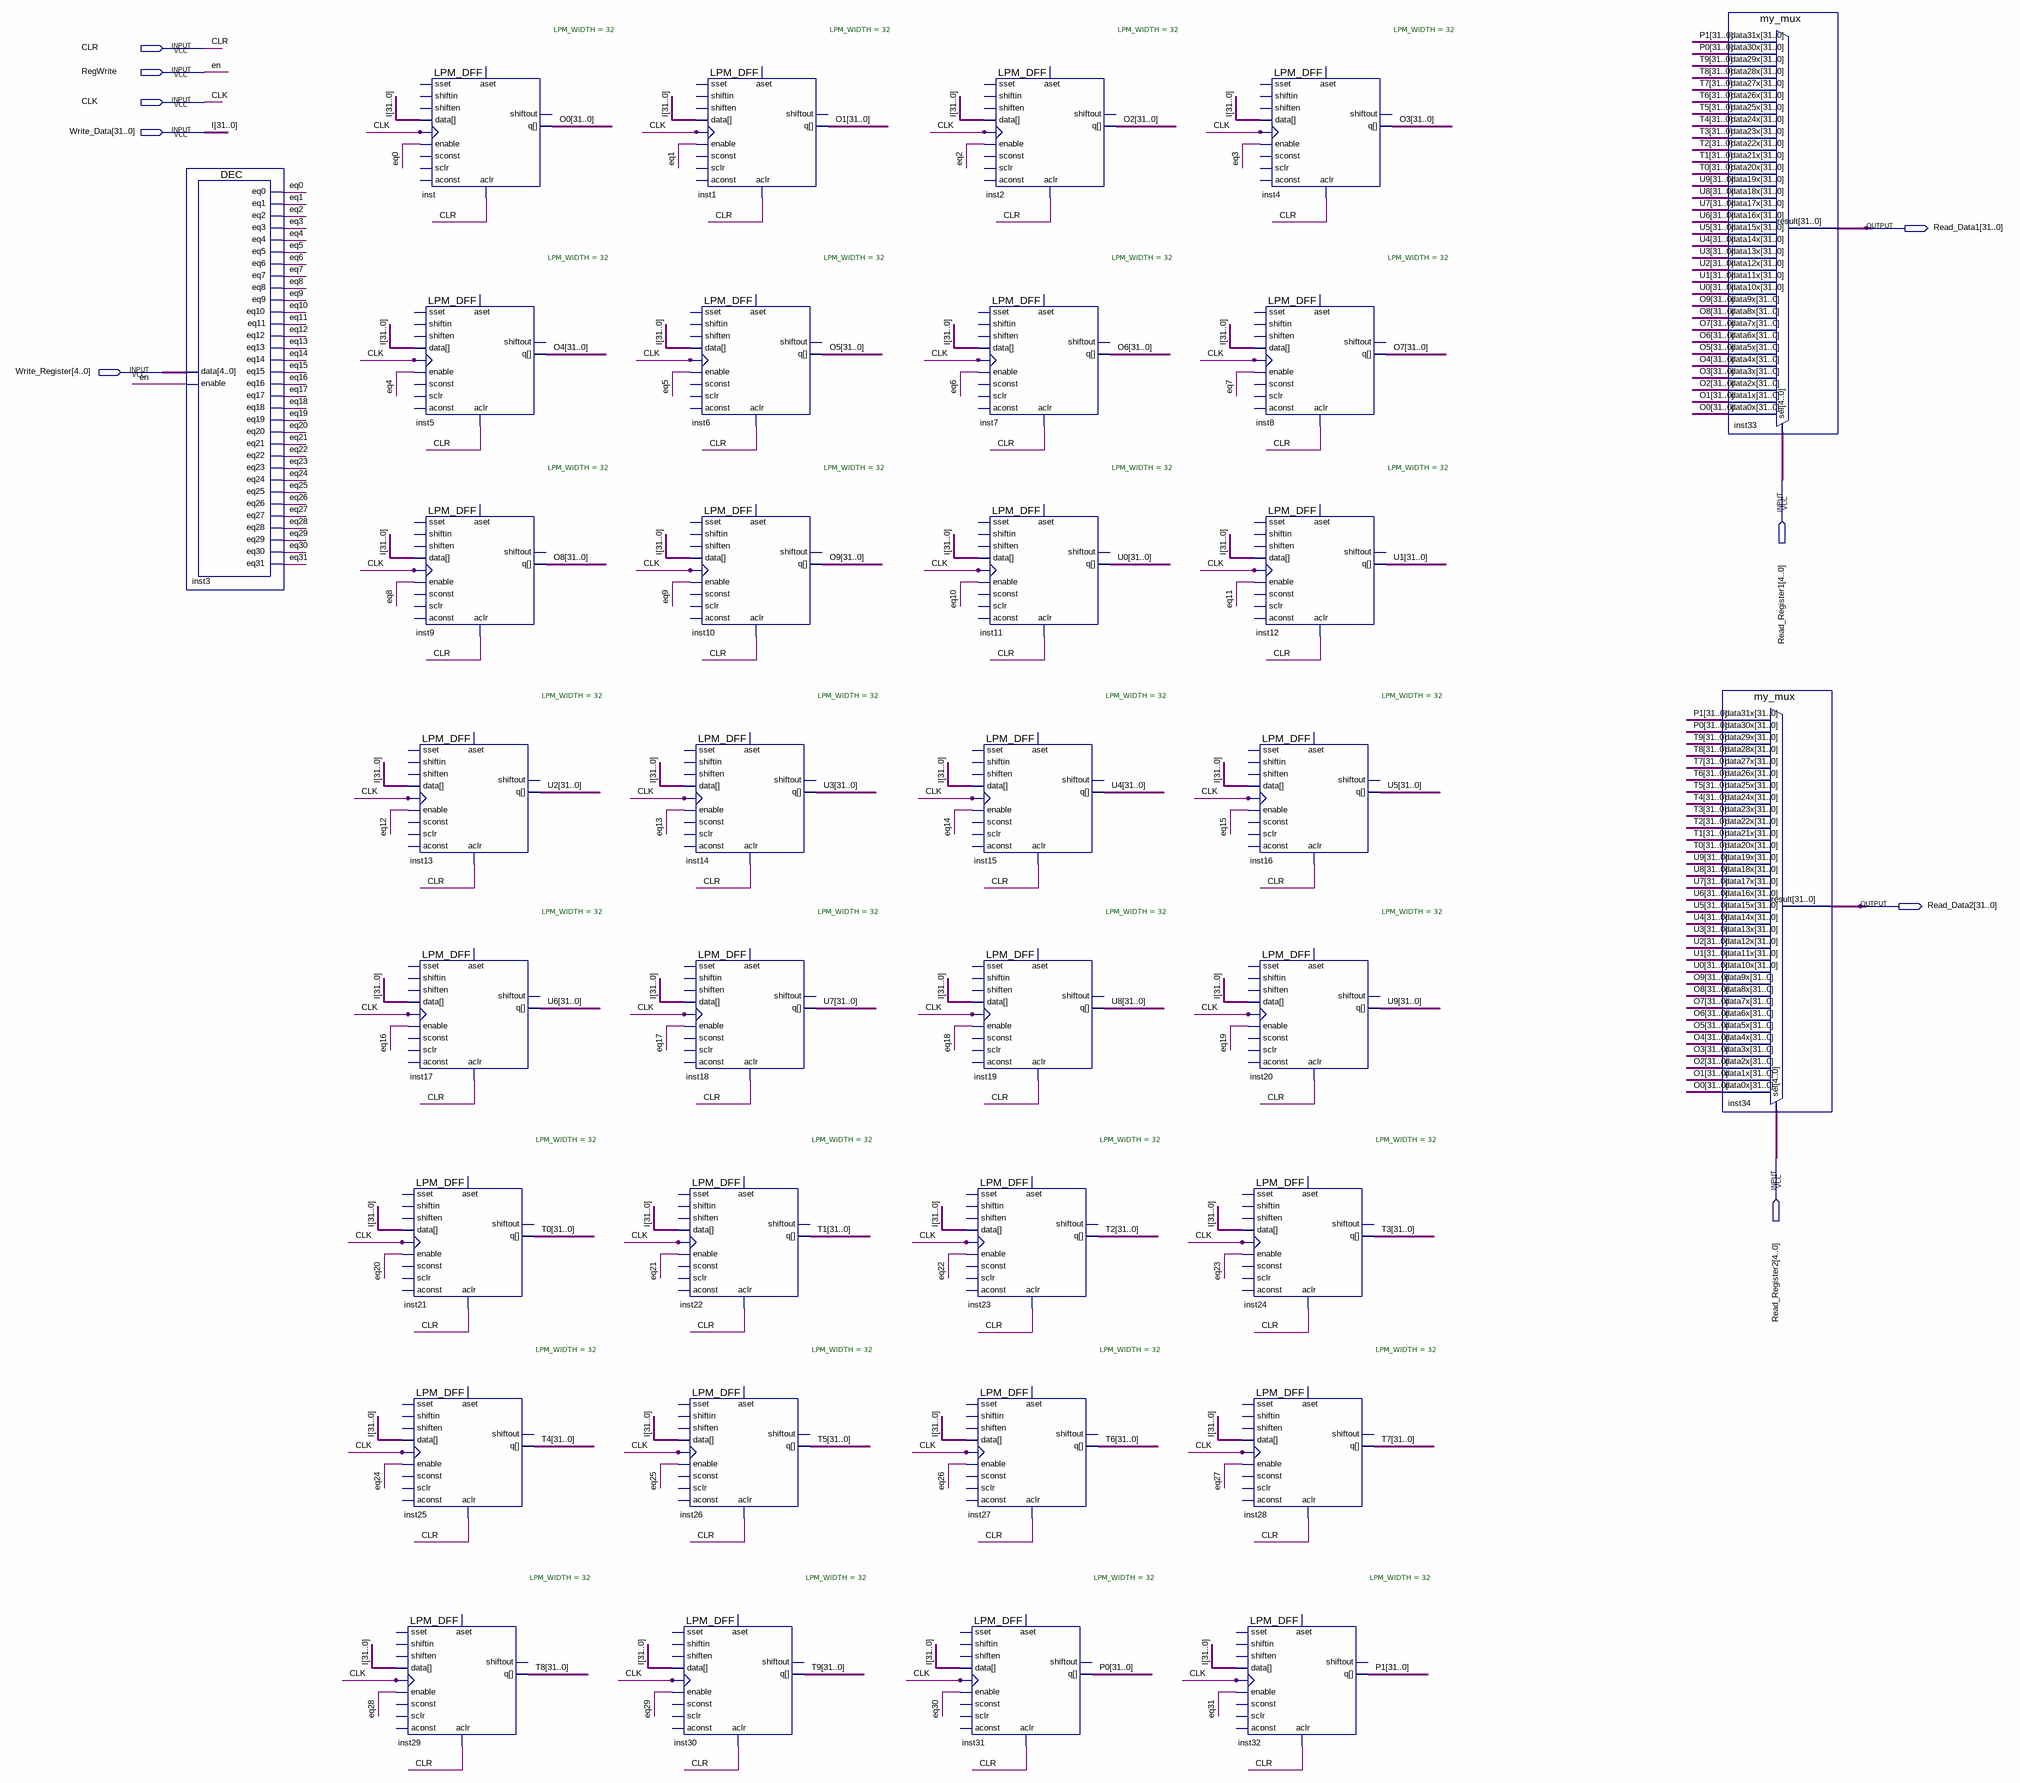
[diagram p0: schematic sheet]
// Quartus schematic registers.bdf as structural Verilog: 35 symbols, 9 pins
module registers (
  input  CLR,
  input  RegWrite,
  input  CLK,
  input  [31:0] Write_Data,
  input  [4:0] Write_Register,
  input  [4:0] Read_Register1,
  input  [4:0] Read_Register2,
  output [31:0] Read_Data1,
  output [31:0] Read_Data2
);

  wire eq0, eq1, eq2, eq3, eq4, eq5, eq6, eq7, eq8, eq9, eq10, eq11, eq12, eq13, eq14, eq15, eq16, eq17,
       eq18, eq19, eq20, eq21, eq22, eq23, eq24, eq25, eq26, eq27, eq28, eq29, eq30, eq31;
  wire [31:0] O0, O1, O2, O3, O4, O5, O6, O7, O8, O9, P0, P1, T0, T1, T2, T3, T4, T5, T6, T7, T8, T9, U0, U1,
       U2, U3, U4, U5, U6, U7, U8, U9;

  DEC inst3 (
    .data(Write_Register), .enable(RegWrite), .eq0(eq0), .eq1(eq1), .eq2(eq2), .eq3(eq3), .eq4(eq4),
    .eq5(eq5), .eq6(eq6), .eq7(eq7), .eq8(eq8), .eq9(eq9), .eq10(eq10), .eq11(eq11), .eq12(eq12),
    .eq13(eq13), .eq14(eq14), .eq15(eq15), .eq16(eq16), .eq17(eq17), .eq18(eq18), .eq19(eq19), .eq20(eq20),
    .eq21(eq21), .eq22(eq22), .eq23(eq23), .eq24(eq24), .eq25(eq25), .eq26(eq26), .eq27(eq27), .eq28(eq28),
    .eq29(eq29), .eq30(eq30), .eq31(eq31));
  LPM_DFF #(.LPM_WIDTH(32)) inst (
    .enable(eq0), .clock(CLK), .data(Write_Data), .aclr(CLR), .q(O0));  // open: shiftin, shiften, aconst, sclr, sconst, sset, aset, shiftout
  LPM_DFF #(.LPM_WIDTH(32)) inst5 (
    .enable(eq4), .clock(CLK), .data(Write_Data), .aclr(CLR), .q(O4));  // open: shiftin, shiften, aconst, sclr, sconst, sset, aset, shiftout
  LPM_DFF #(.LPM_WIDTH(32)) inst9 (
    .enable(eq8), .clock(CLK), .data(Write_Data), .aclr(CLR), .q(O8));  // open: shiftin, shiften, aconst, sclr, sconst, sset, aset, shiftout
  LPM_DFF #(.LPM_WIDTH(32)) inst13 (
    .enable(eq12), .clock(CLK), .data(Write_Data), .aclr(CLR), .q(U2));  // open: shiftin, shiften, aconst, sclr, sconst, sset, aset, shiftout
  LPM_DFF #(.LPM_WIDTH(32)) inst17 (
    .enable(eq16), .clock(CLK), .data(Write_Data), .aclr(CLR), .q(U6));  // open: shiftin, shiften, aconst, sclr, sconst, sset, aset, shiftout
  LPM_DFF #(.LPM_WIDTH(32)) inst21 (
    .enable(eq20), .clock(CLK), .data(Write_Data), .aclr(CLR), .q(T0));  // open: shiftin, shiften, aconst, sclr, sconst, sset, aset, shiftout
  LPM_DFF #(.LPM_WIDTH(32)) inst25 (
    .enable(eq24), .clock(CLK), .data(Write_Data), .aclr(CLR), .q(T4));  // open: shiftin, shiften, aconst, sclr, sconst, sset, aset, shiftout
  LPM_DFF #(.LPM_WIDTH(32)) inst29 (
    .enable(eq28), .clock(CLK), .data(Write_Data), .aclr(CLR), .q(T8));  // open: shiftin, shiften, aconst, sclr, sconst, sset, aset, shiftout
  LPM_DFF #(.LPM_WIDTH(32)) inst1 (
    .enable(eq1), .clock(CLK), .data(Write_Data), .aclr(CLR), .q(O1));  // open: shiftin, shiften, aconst, sclr, sconst, sset, aset, shiftout
  LPM_DFF #(.LPM_WIDTH(32)) inst6 (
    .enable(eq5), .clock(CLK), .data(Write_Data), .aclr(CLR), .q(O5));  // open: shiftin, shiften, aconst, sclr, sconst, sset, aset, shiftout
  LPM_DFF #(.LPM_WIDTH(32)) inst10 (
    .enable(eq9), .clock(CLK), .data(Write_Data), .aclr(CLR), .q(O9));  // open: shiftin, shiften, aconst, sclr, sconst, sset, aset, shiftout
  LPM_DFF #(.LPM_WIDTH(32)) inst14 (
    .enable(eq13), .clock(CLK), .data(Write_Data), .aclr(CLR), .q(U3));  // open: shiftin, shiften, aconst, sclr, sconst, sset, aset, shiftout
  LPM_DFF #(.LPM_WIDTH(32)) inst18 (
    .enable(eq17), .clock(CLK), .data(Write_Data), .aclr(CLR), .q(U7));  // open: shiftin, shiften, aconst, sclr, sconst, sset, aset, shiftout
  LPM_DFF #(.LPM_WIDTH(32)) inst22 (
    .enable(eq21), .clock(CLK), .data(Write_Data), .aclr(CLR), .q(T1));  // open: shiftin, shiften, aconst, sclr, sconst, sset, aset, shiftout
  LPM_DFF #(.LPM_WIDTH(32)) inst26 (
    .enable(eq25), .clock(CLK), .data(Write_Data), .aclr(CLR), .q(T5));  // open: shiftin, shiften, aconst, sclr, sconst, sset, aset, shiftout
  LPM_DFF #(.LPM_WIDTH(32)) inst30 (
    .enable(eq29), .clock(CLK), .data(Write_Data), .aclr(CLR), .q(T9));  // open: shiftin, shiften, aconst, sclr, sconst, sset, aset, shiftout
  LPM_DFF #(.LPM_WIDTH(32)) inst2 (
    .enable(eq2), .clock(CLK), .data(Write_Data), .aclr(CLR), .q(O2));  // open: shiftin, shiften, aconst, sclr, sconst, sset, aset, shiftout
  LPM_DFF #(.LPM_WIDTH(32)) inst7 (
    .enable(eq6), .clock(CLK), .data(Write_Data), .aclr(CLR), .q(O6));  // open: shiftin, shiften, aconst, sclr, sconst, sset, aset, shiftout
  LPM_DFF #(.LPM_WIDTH(32)) inst11 (
    .enable(eq10), .clock(CLK), .data(Write_Data), .aclr(CLR), .q(U0));  // open: shiftin, shiften, aconst, sclr, sconst, sset, aset, shiftout
  LPM_DFF #(.LPM_WIDTH(32)) inst15 (
    .enable(eq14), .clock(CLK), .data(Write_Data), .aclr(CLR), .q(U4));  // open: shiftin, shiften, aconst, sclr, sconst, sset, aset, shiftout
  LPM_DFF #(.LPM_WIDTH(32)) inst19 (
    .enable(eq18), .clock(CLK), .data(Write_Data), .aclr(CLR), .q(U8));  // open: shiftin, shiften, aconst, sclr, sconst, sset, aset, shiftout
  LPM_DFF #(.LPM_WIDTH(32)) inst23 (
    .enable(eq22), .clock(CLK), .data(Write_Data), .aclr(CLR), .q(T2));  // open: shiftin, shiften, aconst, sclr, sconst, sset, aset, shiftout
  LPM_DFF #(.LPM_WIDTH(32)) inst27 (
    .enable(eq26), .clock(CLK), .data(Write_Data), .aclr(CLR), .q(T6));  // open: shiftin, shiften, aconst, sclr, sconst, sset, aset, shiftout
  LPM_DFF #(.LPM_WIDTH(32)) inst31 (
    .enable(eq30), .clock(CLK), .data(Write_Data), .aclr(CLR), .q(P0));  // open: shiftin, shiften, aconst, sclr, sconst, sset, aset, shiftout
  LPM_DFF #(.LPM_WIDTH(32)) inst32 (
    .enable(eq31), .clock(CLK), .data(Write_Data), .aclr(CLR), .q(P1));  // open: shiftin, shiften, aconst, sclr, sconst, sset, aset, shiftout
  LPM_DFF #(.LPM_WIDTH(32)) inst4 (
    .enable(eq3), .clock(CLK), .data(Write_Data), .aclr(CLR), .q(O3));  // open: shiftin, shiften, aconst, sclr, sconst, sset, aset, shiftout
  LPM_DFF #(.LPM_WIDTH(32)) inst8 (
    .enable(eq7), .clock(CLK), .data(Write_Data), .aclr(CLR), .q(O7));  // open: shiftin, shiften, aconst, sclr, sconst, sset, aset, shiftout
  LPM_DFF #(.LPM_WIDTH(32)) inst12 (
    .enable(eq11), .clock(CLK), .data(Write_Data), .aclr(CLR), .q(U1));  // open: shiftin, shiften, aconst, sclr, sconst, sset, aset, shiftout
  LPM_DFF #(.LPM_WIDTH(32)) inst16 (
    .enable(eq15), .clock(CLK), .data(Write_Data), .aclr(CLR), .q(U5));  // open: shiftin, shiften, aconst, sclr, sconst, sset, aset, shiftout
  LPM_DFF #(.LPM_WIDTH(32)) inst20 (
    .enable(eq19), .clock(CLK), .data(Write_Data), .aclr(CLR), .q(U9));  // open: shiftin, shiften, aconst, sclr, sconst, sset, aset, shiftout
  LPM_DFF #(.LPM_WIDTH(32)) inst24 (
    .enable(eq23), .clock(CLK), .data(Write_Data), .aclr(CLR), .q(T3));  // open: shiftin, shiften, aconst, sclr, sconst, sset, aset, shiftout
  LPM_DFF #(.LPM_WIDTH(32)) inst28 (
    .enable(eq27), .clock(CLK), .data(Write_Data), .aclr(CLR), .q(T7));  // open: shiftin, shiften, aconst, sclr, sconst, sset, aset, shiftout
  my_mux inst33 (
    .data31x(P1), .data30x(P0), .data29x(T9), .data28x(T8), .data27x(T7), .data26x(T6), .data25x(T5),
    .data24x(T4), .data23x(T3), .data22x(T2), .data21x(T1), .data20x(T0), .data19x(U9), .data18x(U8),
    .data17x(U7), .data16x(U6), .data15x(U5), .data14x(U4), .data13x(U3), .data12x(U2), .data11x(U1),
    .data10x(U0), .data9x(O9), .data8x(O8), .data7x(O7), .data6x(O6), .data5x(O5), .data4x(O4), .data3x(O3),
    .data2x(O2), .data1x(O1), .data0x(O0), .sel(Read_Register1), .result(Read_Data1));
  my_mux inst34 (
    .data31x(P1), .data30x(P0), .data29x(T9), .data28x(T8), .data27x(T7), .data26x(T6), .data25x(T5),
    .data24x(T4), .data23x(T3), .data22x(T2), .data21x(T1), .data20x(T0), .data19x(U9), .data18x(U8),
    .data17x(U7), .data16x(U6), .data15x(U5), .data14x(U4), .data13x(U3), .data12x(U2), .data11x(U1),
    .data10x(U0), .data9x(O9), .data8x(O8), .data7x(O7), .data6x(O6), .data5x(O5), .data4x(O4), .data3x(O3),
    .data2x(O2), .data1x(O1), .data0x(O0), .sel(Read_Register2), .result(Read_Data2));

  // Other names for the same wires on the sheet: en = RegWrite; I[31:0] = Write_Data
endmodule
